# EAGLE schematic source_eagle (EAGLE 9.6.2)
COMPANY: ADAFRUIT INDUSTRIES; DRAWN: KTOWN; REV: A; YEAR: 2019
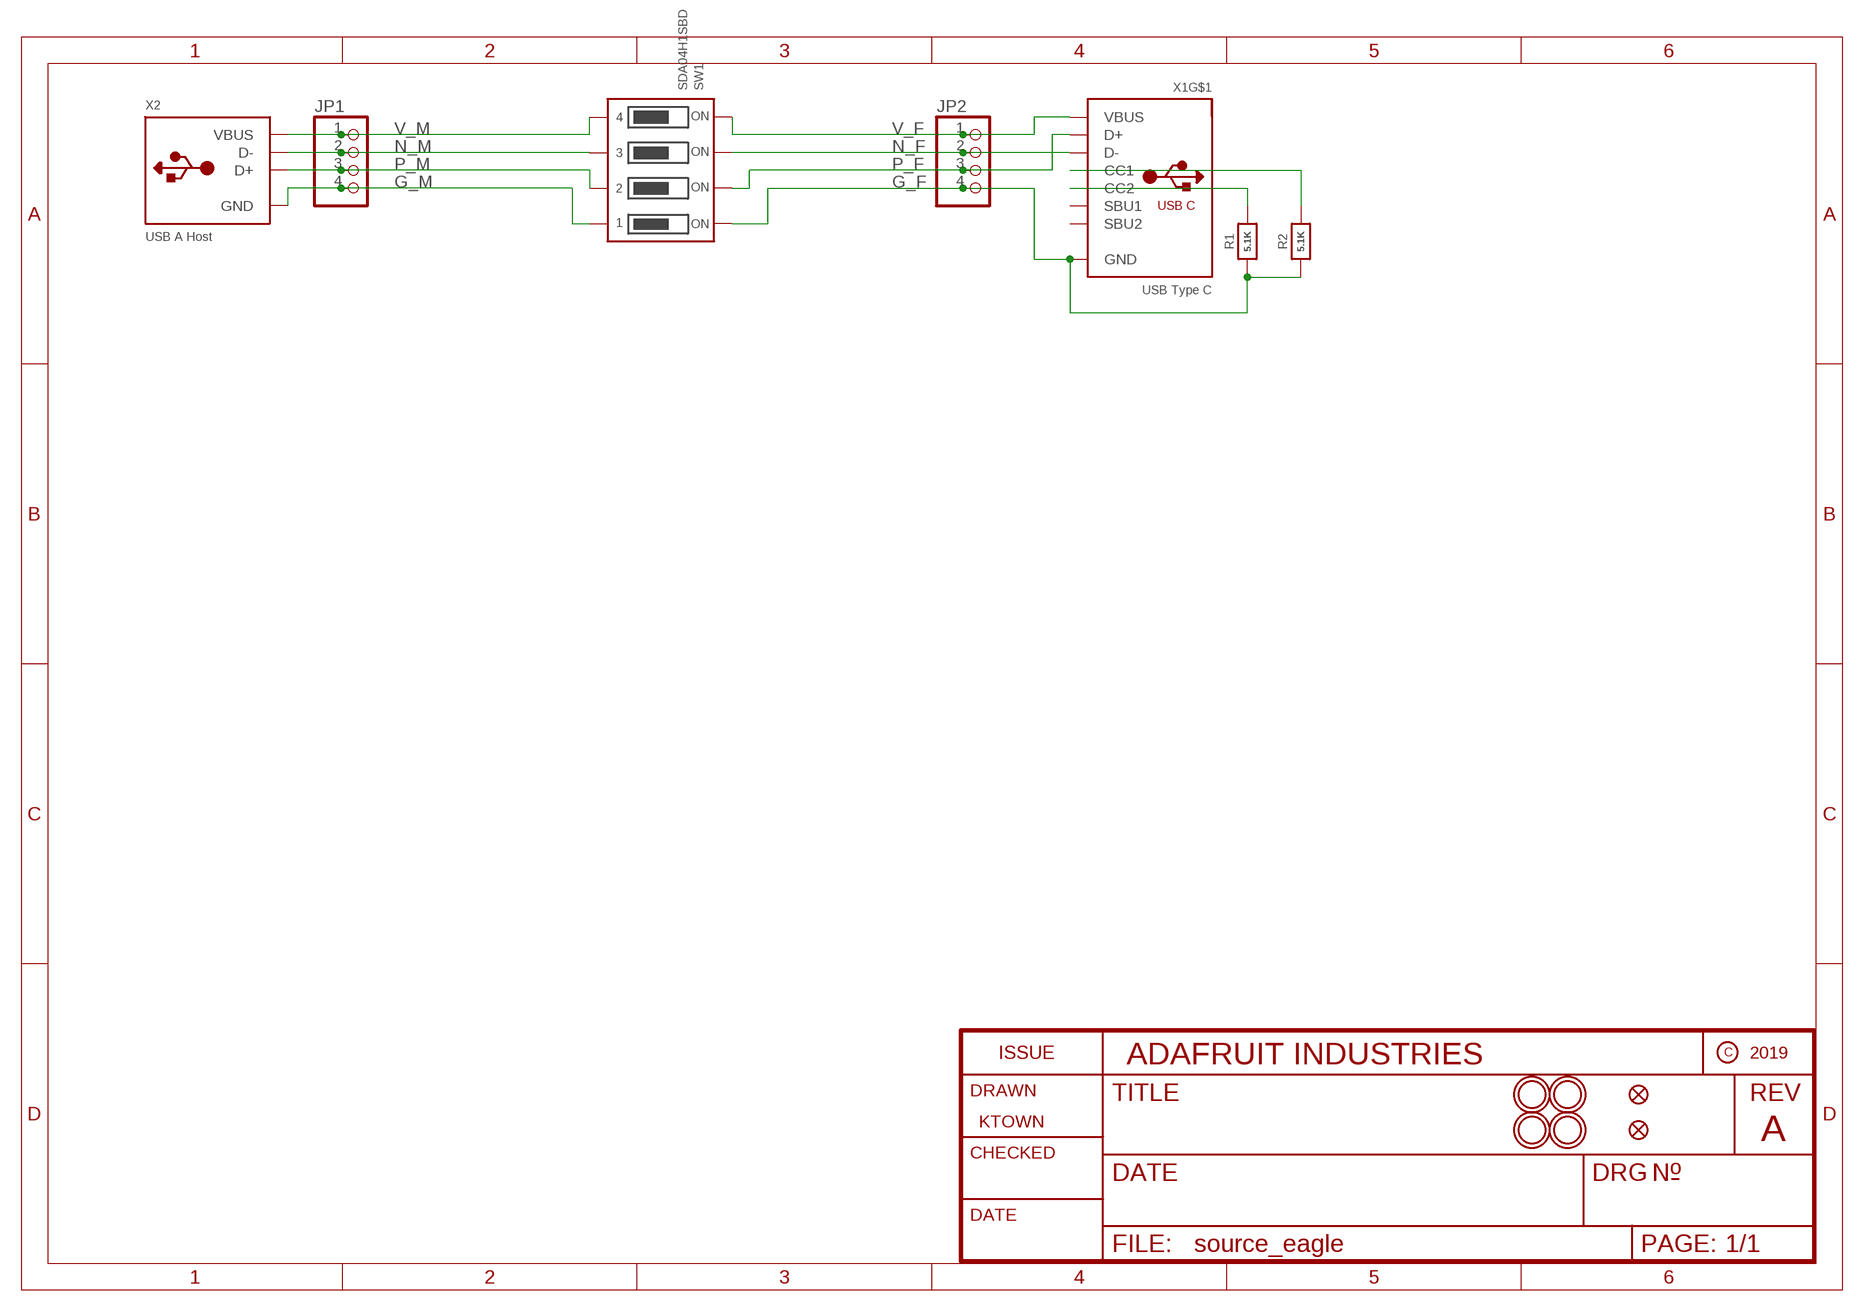
[diagram p0: schematic, sheet 1]

## Parts
FID1  FIDUCIAL_1MM  [FIDUCIAL_1MM]
FID2  FIDUCIAL_1MM  [FIDUCIAL_1MM]
JP1  HEADER-1X4ROUND  [1X04_ROUND]
JP2  HEADER-1X4ROUND  [1X04_ROUND]
R1  5.1K  RESISTOR_0603_NOOUT  [0603-NO]
R2  5.1K  RESISTOR_0603_NOOUT  [0603-NO]
SW1  SDA04H1SBD  DIPSWITCH_4PIN  [DIPSWITCH_4PIN]
U$1  MOUNTINGHOLE2.5  [MOUNTINGHOLE_2.5_PLATED]
U$2  MOUNTINGHOLE2.5  [MOUNTINGHOLE_2.5_PLATED]
U$3  MOUNTINGHOLE2.5  [MOUNTINGHOLE_2.5_PLATED]
U$4  MOUNTINGHOLE2.5  [MOUNTINGHOLE_2.5_PLATED]
X1  USB Type C  USB_C  [USB_C_CUSB31-CFM2AX-01-X]
X2  USB A Host  USB_TYPEAPTHFML  [USB_HOST-PTH]

## Nets
G_F: JP2.4 R1.1 R2.1 SW1.1ON X1.A1B12(GND) X1.B1A12(GND)
G_M: JP1.4 SW1.1OFF X2.GND
N$3: R1.2 X1.B5(CC2)
N$4: R2.2 X1.A5(CC1)
N_F: JP2.2 SW1.3ON X1.A7(D-) X1.B7(D-)
N_M: JP1.2 SW1.3OFF X2.D-
P_F: JP2.3 SW1.2ON X1.A6(D+) X1.B6(D+)
P_M: JP1.3 SW1.2OFF X2.D+
V_F: JP2.1 SW1.4ON X1.A4B9(VBUS) X1.B4A9(VBUS)
V_M: JP1.1 SW1.4OFF X2.VBUS
Unconnected: X1.A8(SBU1) X1.B8(SBU2) X1.M1(MT) X1.M2(MT) X1.M3(MT) X1.M4(MT)

## Library data of the parts
FID1 FID2 = microbuilder:FIDUCIAL: Fiducial Alignment Points Various fiducial points for machine vision alignment.; BOM: EXCLUDE
JP1 JP2 = microbuilder:HEADER-1X4: PIN HEADER
R1 R2 = microbuilder:RESISTOR: Resistors For new designs, use the packages preceded by an '_' character since they are more reliable: The following footprints should be used on most boards: _0402 - Standard footprint for regular board layouts _0603 - Standard footprint for regular board layouts _0805 - Standard footprint for regular board layouts _1206 - Standard footprint for regular board layouts For extremely tight-pitch boards where space is at a premium, the following 'micro-pitch' footprints can be used (smaller pads, no silkscreen outline, etc.): _0402MP - Micro-pitch footprint for very dense/compact boards _0603MP - Micro-pitch footprint for very dense/compact boards _0805MP - Micro-pitch footprint for very dense/compact boards _1206MP - Micro-pitch footprint for very dense/compact boards
SW1 = adafruit_electromech:DIPSWITCH_4PIN: DIP Switch - 4 Pin - [4UConnector: 19494]
U$1-U$4 = adafruit_electromech:MOUNTINGHOLE: Mounting Hole For #2 screws (0.086"/2.18mm width, 0.094"/2.4mm hole) use 2.5mm; BOM: EXCLUDE
X1 = adafruit_electromech:USB_C: USB Type-C USB 2.0 Connector; LCSC: C165948
X2 = adafruit_electromech:USB_TYPEA: USB - Type A Connectors Male types stick out and are inserted into a PC or matching females parts (these are the connectors used on USB Memory Sticks, etc.). Female parts are generally used for USB Host and accept a male-type connector. SMT - 4UCON: 10017 PTHFML - Digikey: 609-1045-ND, 4UCon: 05241 PCB - Use 2.0mm thick PCBs with this footprint